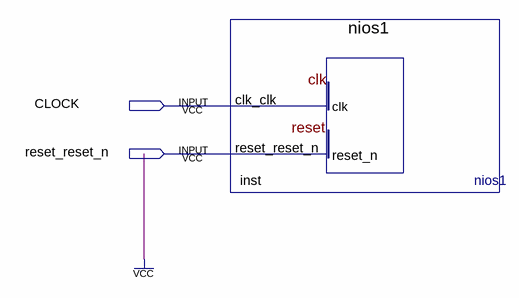
[diagram p0: schematic sheet]
// Quartus schematic nios2.bdf as structural Verilog: 1 symbols, 2 pins
module nios2 (
  input  CLOCK,
  input  reset_reset_n
);

  nios1 inst (.clk_clk(CLOCK), .reset_reset_n(reset_reset_n));
endmodule
